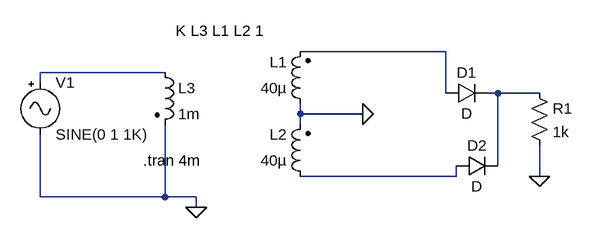
[diagram p0: schematic Draft2.asc]
Draft2.asc, the LTspice schematic file:
Version 4
SHEET 1 880 680
WIRE 224 0 0 0
WIRE -208 32 -400 32
WIRE -400 48 -400 32
WIRE 224 64 224 0
WIRE 304 64 288 64
WIRE 368 64 304 64
WIRE 0 96 0 80
WIRE 96 96 0 96
WIRE 0 112 0 96
WIRE 304 176 304 64
WIRE 240 192 240 176
WIRE 240 192 0 192
WIRE 368 192 368 144
WIRE -400 224 -400 128
WIRE -208 224 -208 112
WIRE -208 224 -400 224
WIRE -160 224 -208 224
WIRE -160 240 -160 224
FLAG 368 192 0
FLAG 96 96 0
FLAG -160 240 0
SYMBOL Misc\\signal -400 32 R0
SYMATTR InstName V1
SYMBOL diode 224 80 R270
WINDOW 0 32 32 VTop 2
WINDOW 3 0 32 VBottom 2
SYMATTR InstName D1
SYMBOL diode 240 192 R270
WINDOW 0 32 32 VTop 2
WINDOW 3 0 32 VBottom 2
SYMATTR InstName D2
SYMBOL res 352 48 R0
SYMATTR InstName R1
SYMATTR Value 1k
SYMBOL ind2 16 96 R180
WINDOW 0 36 80 Left 2
WINDOW 3 36 40 Left 2
SYMATTR InstName L1
SYMATTR Value 40µ
SYMATTR Type ind
SYMBOL ind2 16 208 R180
WINDOW 0 36 80 Left 2
WINDOW 3 36 40 Left 2
SYMATTR InstName L2
SYMATTR Value 40µ
SYMATTR Type ind
SYMBOL ind2 -224 16 R0
SYMATTR InstName L3
SYMATTR Value 1m
SYMATTR Type ind
TEXT -242 168 Left 2 !.tran 4m
TEXT -192 -32 Left 2 !K L3 L1 L2 1

The netlist it stands for:
* Draft2.asc
V1 N002 0 SINE(0 1 1K)
D1 N001 N003 D
D2 N004 N003 D
R1 N003 0 1k
L1 0 N001 40µ
L2 N004 0 40µ
L3 N002 0 1m
.model D D
.lib standard.dio
.tran 4m
K L3 L1 L2 1
.backanno
.end